# Altium schematic sheet COVER PAGE.SchDoc
size 420 x 297 mm; SheetNumber: 1; SheetTotal: 14
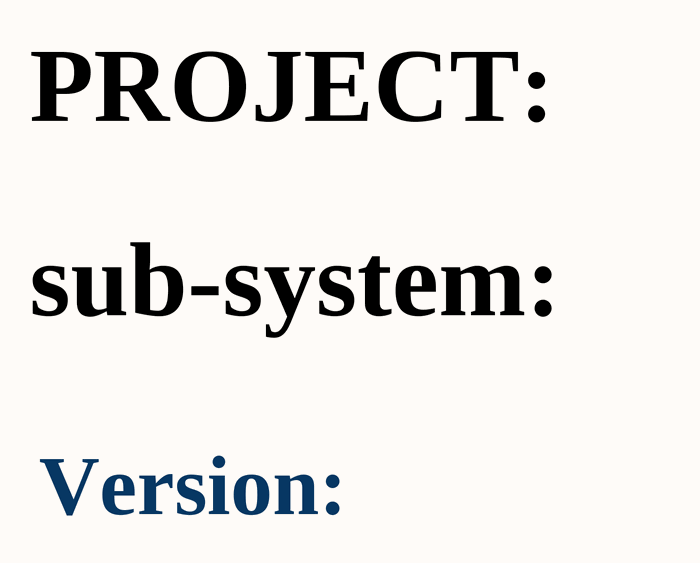
[diagram p0: COVER PAGE.SchDoc]

## Notes on the sheet
- PROJECT:
- sub-system:
- Version:
- Project:
- Sub-system:
- Design by:
- Sheet title:
- Sheet
- of
- Checked by:
- Approved by:
- Revision:
- Document No:
- Size:
- Date:
- A3